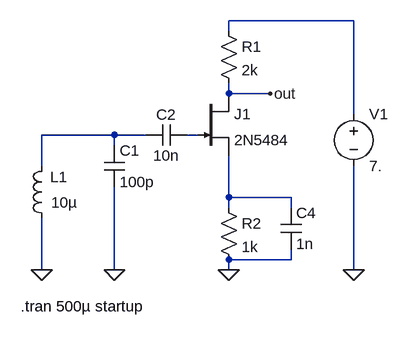
[diagram p0: schematic colpits.asc]
colpits.asc, the LTspice schematic file:
Version 4
SHEET 1 2600 2480
WIRE 2400 1872 2208 1872
WIRE 2208 1888 2208 1872
WIRE 2208 1984 2208 1968
WIRE 2272 1984 2208 1984
WIRE 2400 2016 2400 1872
WIRE 2032 2048 1920 2048
WIRE 2080 2048 2032 2048
WIRE 2160 2048 2144 2048
WIRE 2032 2064 2032 2048
WIRE 1920 2096 1920 2048
WIRE 2208 2144 2208 2080
WIRE 2304 2144 2208 2144
WIRE 2208 2160 2208 2144
WIRE 2304 2160 2304 2144
WIRE 2304 2240 2304 2224
WIRE 2304 2240 2208 2240
WIRE 1920 2256 1920 2176
WIRE 2032 2256 2032 2128
WIRE 2208 2256 2208 2240
WIRE 2400 2256 2400 2096
FLAG 1920 2256 0
FLAG 2032 2256 0
FLAG 2208 2256 0
FLAG 2400 2256 0
FLAG 2272 1984 out
SYMBOL NJF 2160 1984 R0
SYMATTR InstName J1
SYMATTR Value 2N5484
SYMBOL RES 2192 1872 R0
SYMATTR InstName R1
SYMATTR Value 2k
SYMBOL res 2192 2144 R0
SYMATTR InstName R2
SYMATTR Value 1k
SYMBOL ind 1936 2192 R180
WINDOW 0 3 79 Right 0
WINDOW 3 1 40 Right 0
SYMATTR InstName L1
SYMATTR Value 10µ
SYMBOL cap 2016 2064 R0
SYMATTR InstName C1
SYMATTR Value 100p
SYMBOL VOLTAGE 2400 2000 R0
SYMATTR InstName V1
SYMATTR Value 7.
SYMBOL cap 2288 2160 R0
SYMATTR InstName C4
SYMATTR Value 1n
SYMBOL cap 2144 2032 R90
WINDOW 0 0 32 VBottom 0
WINDOW 3 32 32 VTop 0
SYMATTR InstName C2
SYMATTR Value 10n
TEXT 1888 2312 Left 0 !.tran 500µ startup

The netlist it stands for:
* colpits.asc
J1 out N003 N004 2N5484
R1 N001 out 2k
R2 N004 0 1k
L1 0 N002 10µ
C1 N002 0 100p
V1 N001 0 7.
C4 N004 0 1n
C2 N003 N002 10n
.model NJF NJF
.model PJF PJF
.lib standard.jft
.tran 500µ startup
.backanno
.end